# Altium schematic sheet DSV1-002（电池保护板） REV0.1 20230223.SchDoc: DSV1-002
size A4; ApprovedBy: 戚大周; Organization: 湖北滴水科技有限公司; Revision: REV0.1 20221208; SheetNumber: 1; SheetTotal: 1
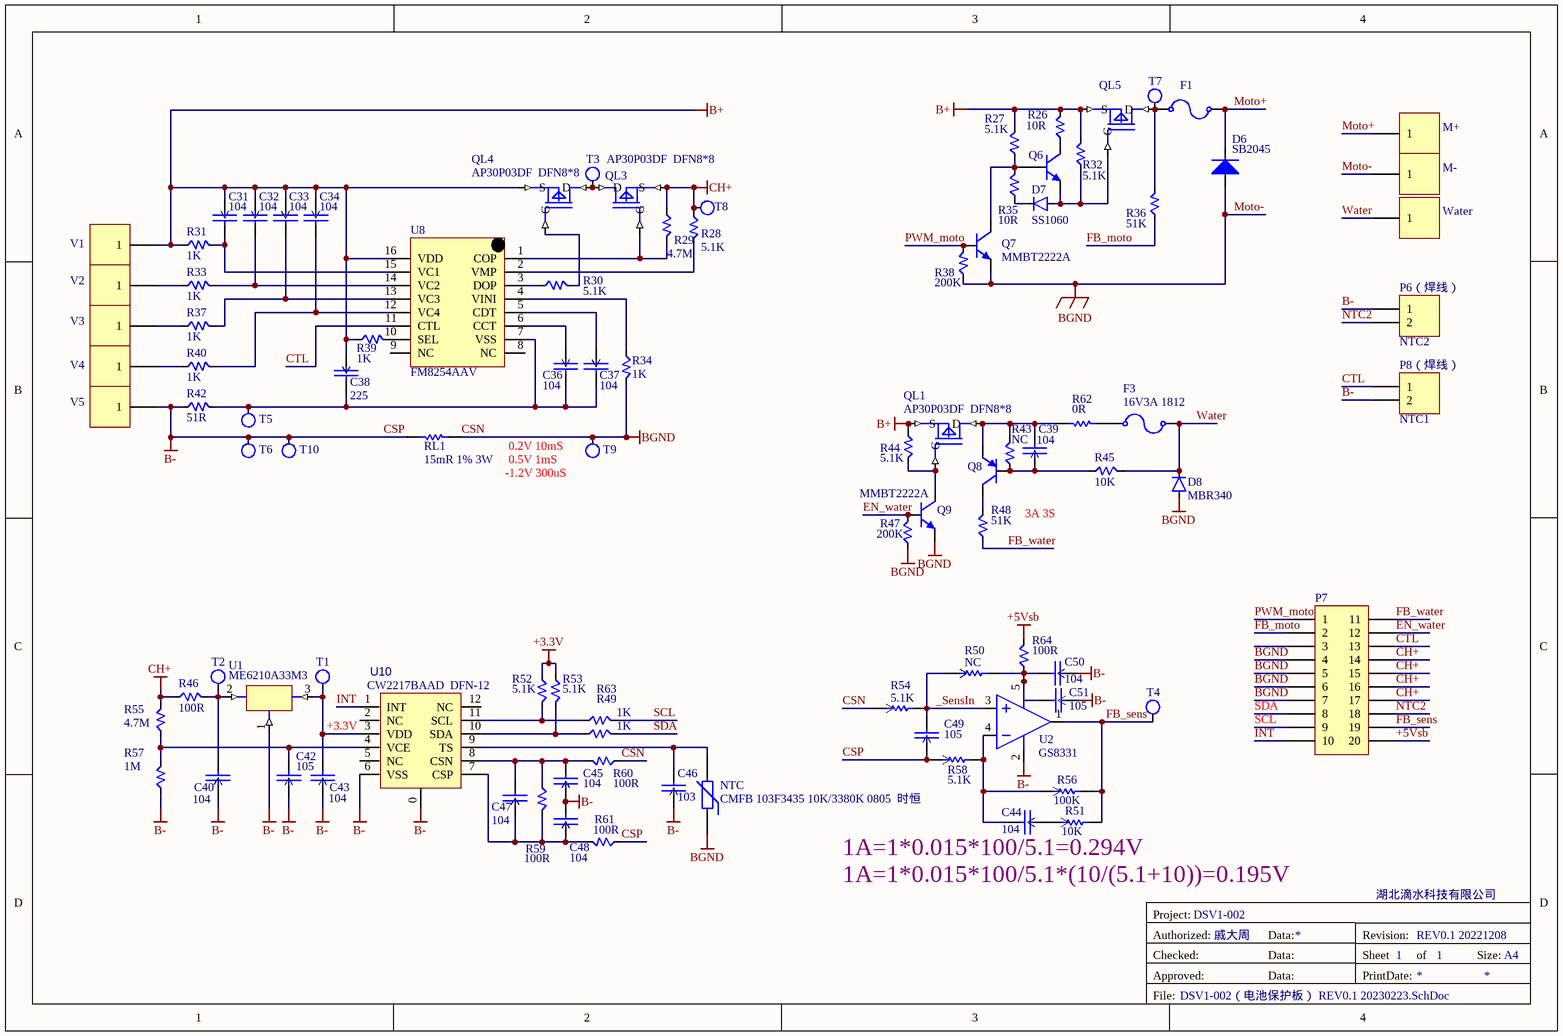
[diagram p0: DSV1-002（电池保护板） REV0.1 20230223.SchDoc]

## Parts
C31  104  [0603c]
C32  104  [0603c]
C33  104  [0603c]
C34  104  [0603c]
C36  104  [0603c]
C37  104  [0603c]
C38  225  [0603c]
C39  104  [0603C]
C40  104  [0603c]
C42  105  [0603C]
C43  104  [0603c]
C44  104  [0603C]
C45  104  [0603C]
C46  103  [0603C]
C47  104  [0603C]
C48  104  [0603C]
C49  105  [0603C]
C50  104  [0603C]
C51  105  [0603C]
D6  SB2045  [TO-277]
D7  SS1060  [SOD-123]
D8  MBR340  [SOD-123]
F1  (no value)  [1206-R]
F3  16V3A 1812  [1206-R]
M+  焊盘  [tp]  (value not drawn)
M-  焊盘  [tp]  (value not drawn)
NTC  规格: CMFB 103F3435 10K/3380K 0805  时恒  [6-0805]  (hidden comment: Res Varistor)
P6（焊线）  NTC2  [HDR1X2]
P7  (no value)  [HDR2X10]
P8（焊线）  NTC1  [HDR1X2]
Q6  MMBT2222A  [SOT-23-ss]  (value not drawn)
Q7  MMBT2222A  [SOT-23-ss]
Q8  MMBT2907A  [SOT-23-ss]  (value not drawn)
Q9  MMBT2222A  [SOT-23-ss]
QL1  规格: AP30P03DF  DFN8*8  [TO-252]  (hidden comment: MOS-P)
QL3  规格: AP30P03DF  DFN8*8  [TO-252]  (hidden comment: MOS-P)
QL4  规格: AP30P03DF  DFN8*8  [TO-252]  (hidden comment: MOS-P)
QL5  (no value)  [TO-252]
R26  10R  [0805R]
R27  5.1K  [0603R]
R28  5.1K  [0603R]
R29  4.7M  [0603R]
R30  5.1K  [0603R]
R31  1K  [0603R]
R32  5.1K  [0603R]
R33  1K  [0603R]
R34  1K  [0603R]
R35  10R  [0805R]
R36  51K  [0603R]
R37  1K  [0603R]
R38  200K  [0603R]
R39  1K  [0603R]
R40  1K  [0603R]
R42  51R  [0603R]
R43  NC  [0603R]
R44  5.1K  [0603R]
R45  10K  [0603R]
R46  100R  [0603R]
R47  200K  [0603R]
R48  51K  [0603R]
R49  1K  [0603R]
R50  NC  [0603R]
R51  10K  [0603R]
R52  5.1K  [0603R]
R53  5.1K  [0603R]
R54  5.1K  [0603R]
R55  4.7M  [0603R]
R56  100K  [0603R]
R57  1M  [0603R]
R58  5.1K  [0603R]
R59  100R  [0603R]
R60  100R  [0603R]
R61  100R  [0603R]
R62  0R  [2512R]
R63  1K  [0603R]
R64  100R  [0603R]
RL1  15mR 1% 3W  [2512R]
T1  (no value)  [TP]
T2  (no value)  [TP]
T3  (no value)  [TP]
T4  (no value)  [TP]
T5  (no value)  [TP]
T6  (no value)  [TP]
T7  (no value)  [TP]
T8  (no value)  [TP]
T9  (no value)  [TP]
T10  (no value)  [TP]
U1  ME6210A33M3  [SOT-23]
U2  GS8331  [SOT-23-5]
U8  FM8254AAV  [TSSOP16]
U10  规格: CW2217BAAD  DFN-12  [SO-8-0]
V1  4*5  [4.8mm 插片端子]  (value not drawn)
V2  4*4  [4.8mm 插片端子]  (value not drawn)
V3  4*4  [4.8mm 插片端子]  (value not drawn)
V4  4*4  [4.8mm 插片端子]  (value not drawn)
V5  4*5  [4.8mm 插片端子]  (value not drawn)
Water  焊盘  [tp]  (value not drawn)

## Nets
+3.3V: C43.2 R52.2 R53.2 T1.1 U1.3 U10.3(VDD)
+5Vsb: P7.20 R64.1
B+: C31.1 C32.1 C33.1 C34.1 C38.1 QL1.S QL4.S QL5.S R26.1 R27.1 R31.1 R32.1 R39.1 R44.2 U8.16(VDD) V1.1
B-: C40.1 C42.1 C43.1 C45.1 C46.1 C48.2 C49.1 C50.1 C51.1 P6（焊线）.1 P8（焊线）.2 R42.1 R57.1 R58.1 R61.1 RL1.1 T6.1 T10.1 U1.1 U2.2(V-) U10.0 U10.6(VSS) V5.1  [also labelled CSP]
BGND: D6.1(A) D8.1 M-.1 NTC.1 P7.4 P7.5 P7.6 P7.7 Q7.2 Q9.2 R34.2 R38.1 R47.2 R54.1 R60.1 RL1.2 T9.1  [also labelled CSN, Moto-]
CH+: P7.14 P7.15 P7.16 P7.17 QL3.S R28.1 R29.1 R46.1 R55.2 T8.1
_SensIn: C49.2 R50.1 R54.2 U2.3(IN+)
CTL: P7.13 P8（焊线）.1 U8.11(CTL)
EN_water: P7.12 Q9.1 R47.1
FB_moto: P7.2 R36.1
FB_sens: P7.19 R51.2 R56.2 T4.1 U2.1(OUT)
FB_water: P7.11 R48.2
INT: P7.10 U10.1(INT)
Moto+: D6.2(K) F1.1 M+.1
NTC2: P6（焊线）.2 P7.18
PWM_moto: P7.1 Q7.1 R38.2
SCL: P7.9 R63.1
SDA: P7.8 R49.1
Water: D8.2 F3.1 R45.1 Water.1
NetC31_2: C31.2 R31.2 U8.15(VC1)
NetC32_2: C32.2 R33.2 U8.14(VC2)
NetC33_2: C33.2 R37.2 U8.13(VC3)
NetC34_2: C34.2 R40.2 U8.12(VC4)
NetC36_1: C36.1 U8.6(CCT)
NetC36_2: C36.2 C37.2 C38.2 R42.2 T5.1 U8.7(VSS)
NetC37_1: C37.1 U8.5(CDT)
NetC39_1: C39.1 Q8.1 R43.2 R45.2
NetC39_2: C39.2 Q8.2 QL1.D R43.1 R62.1
NetC40_2: C40.2 R46.2 T2.1 U1.2
NetC42_2: C42.2 R55.1 R57.2 U10.4(VCE)
NetC44_1: C44.1 R51.1
NetC44_2: C44.2 R56.1 R58.2 U2.4(IN-)
NetC45_2: C45.2 C47.2 R59.1 R60.2 U10.8(CSN)
NetC46_2: C46.2 NTC.2 U10.9(TS)
NetC47_1: C47.1 C48.1 R59.2 R61.2 U10.7(CSP)
NetC50_2: C50.2 C51.2 R50.2 R64.2 U2.5(V+)
NetD7_1: D7.1 Q6.2 QL5.G R32.2
NetD7_2: D7.2 R35.2
NetF1_2: F1.2 QL5.D R36.2 T7.1
NetF3_2: F3.2 R62.2
NetQ6_1: Q6.1 Q7.3 R27.2 R35.1
NetQ6_3: Q6.3 R26.2
NetQ8_3: Q8.3 R48.1
NetQ9_3: Q9.3 QL1.G R44.1
NetQL3_D: QL3.D QL4.D T3.1
NetQL3_G: QL3.G R29.2 U8.1(COP)
NetQL4_G: QL4.G R30.2
NetR28_2: R28.2 U8.2(VMP)
NetR30_1: R30.1 U8.3(DOP)
NetR33_1: R33.1 V2.1
NetR34_1: R34.1 U8.4(VINI)
NetR37_1: R37.1 V3.1
NetR39_2: R39.2 U8.10(SEL)
NetR40_1: R40.1 V4.1
NetR49_2: R49.2 R53.1 U10.10(SDA)
NetR52_1: R52.1 R63.2 U10.11(SCL)

Not connected (* = marked no-connect by the designer): P7 3; U8 8(NC) 9(NC); U10 2(NC) 5(NC) 12(NC)

## Notes on the sheet
- (near T9) 0.2V 10mS
- (near T9) -1.2V 300uS
- (near T9) 0.5V 1mS
- 3A 3S
- 1A=1*0.015*100/5.1*(10/(5.1+10))=0.195V
- 1A=1*0.015*100/5.1=0.294V
- Project:
- Authorized:
- Checked:
- Approved:
- Data:
- Revision:
- Sheet
- PrintDate:
- of
- Size:
- A4
- File:

## Library data of the parts
C31-C34 C36 C37 C39 C40 C43-C45 C47 C48 C50 = CAP: Capacitor; 规格: 104/50V  0603  X7R  ±10%; 名称: 贴片电容
C38 = CAP: Capacitor; 规格: 225/50V  0603  X7R  ±10%; 名称: 贴片电容
C42 C49 C51 = CAP: Capacitor; 规格: 105/50V  0603  X7R  ±10%; 名称: 贴片电容
C46 = CAP: Capacitor; 规格: 103/50V  0603  X7R  ±10%; 名称: 贴片电容
D6 = Diode 1N4448: High Conductance Fast Diode; 规格: SB2045L  TO-277A 20A45V肖特基二极管   平伟; 名称: 贴片二极管
D7 = 1N4148: 规格: SS1060FL   1A/60V     SOD-123FL; 名称: 贴片二极管
D8 = 1N4148: 规格: LMBR340FT1G   3A/40V     SOD-123FL; 名称: 贴片二极管
F1 = FUSe-a: Fuse; 规格: JFC1206-2150FS  24V15A  集电通; 名称: 贴片保险丝
F3 = FUSe-a: Fuse; 规格: 可恢复保险丝PPTC  1812  3A/16V; 名称: 贴片PTC
M+ M- Water = Header 2: Header, 2-Pin; 规格: NC（焊盘）; 名称: 贴片端子
NTC = Res Varistor: Varistor (Voltage-Sensitive Resistor); 名称: 贴片NTC
P6（焊线） = Header 2: Header, 2-Pin; 名称: 插件NTC; 规格: NC
P7 = Header 10X2: Header, 10-Pin, Dual row; 名称: 贴片连接器; 规格: SGDBM-08-020P-H70 公座  深圳山谷道
P8（焊线） = Header 2: Header, 2-Pin; 名称: 插件温控开关; 规格: KSD9700MS 15*5.4*2.5mm 70℃  2A  28号硅胶线,总长20mm剥皮镀锡3mm
Q6 Q7 Q9 = 2N3904: NPN General Purpose Amplifier; 规格: MMBT2222A  SOT-23  长电; 名称: 贴片三极管
Q8 = 2N3906: PNP General Purpose Amplifier; 规格: MMBT2907A  SOT-23  长电; 名称: 贴片三极管
QL1 QL3 QL4 = MOS-P: 名称: 贴片PMOS管
QL5 = MOS-P: 规格: NCE40P70K  TO-252  NCE; 名称: 贴片PMOS管
R26 R35 = 电阻 - R: 规格: +片状电阻0805/10Ω1/10W±1%; 名称: 贴片电阻
R27 R28 R30 R32 R44 R52 R53 = 电阻 - R: 规格: +片状电阻0603/5.1KΩ1/10W±1%; 名称: 贴片电阻
R29 R55 = 电阻 - R: 规格: +片状电阻0603/4.7MΩ1/10W±1%; 名称: 贴片电阻
R31 R33 R34 R37 R39 R40 R49 R63 = 电阻 - R: 规格: +片状电阻0603/1KΩ1/10W±1%; 名称: 贴片电阻
R36 R48 = 电阻 - R: 规格: +片状电阻0603/51KΩ1/10W±1%; 名称: 贴片电阻
R38 R47 = 电阻 - R: 规格: +片状电阻0603/200KΩ1/10W±1%; 名称: 贴片电阻
R42 = 电阻 - R: 规格: +片状电阻0603/51Ω1/10W±1%; 名称: 贴片电阻
R43 = 电阻 - R: 名称: 贴片电阻; 规格: NC
R45 = 电阻 - R: 规格: +片状电阻0603/10KΩ1/10W±1%; 名称: 贴片电阻
R46 R59-R61 R64 = 电阻 - R: 规格: +片状电阻0603/100Ω1/10W±1%; 名称: 贴片电阻
R50 = RES1: 名称: 贴片电阻; 规格: NC
R51 = RES1: 规格: +片状电阻0603/10KΩ1/10W±1%; 名称: 贴片电阻
R54 R58 = RES1: 规格: +片状电阻0603/5.1KΩ1/10W±1%; 名称: 贴片电阻
R56 = RES1: 规格: +片状电阻0603/100KΩ1/10W±1%; 名称: 贴片电阻
R57 = 电阻 - R: 规格: +片状电阻0603/1MΩ1/10W±1%; 名称: 贴片电阻
R62 = Res_1206/0.05R: 规格: +片状电阻1206/0Ω1/8W±5%; 名称: 贴片电阻
RL1 = Res_1206/0.05R: 规格: 合金电阻 2512/0.015Ω  3W±1%; 名称: 贴片电阻
T1-T10 = TP: 规格: NC; 名称: 测试点
U1 = ME6203: 规格: ME6210A33M3 Vout=±0.06%  Iss=1.5uA SOT89 微盟; 名称: 贴片IC
U2 = LMV321TP-TR: 规格: GS8331-TR  SOT23-5  Gainsil聚洵; 名称: 贴片IC
U8 = SOP-16_1: 规格: FM8254AAV  TSSOP-16  富满电子; 名称: 贴片IC
U10 = IC SOT-12: 名称: 贴片IC
V1 V5 = Header 2: 规格: 4*5*0.3mm  镍片点焊专用焊盘; 名称: 贴片点焊焊盘
V2-V4 = Header 2: 规格: 4*4*0.3mm  镍片点焊专用焊盘; 名称: 贴片点焊焊盘